# EAGLE schematic PF (EAGLE 9.6.2)
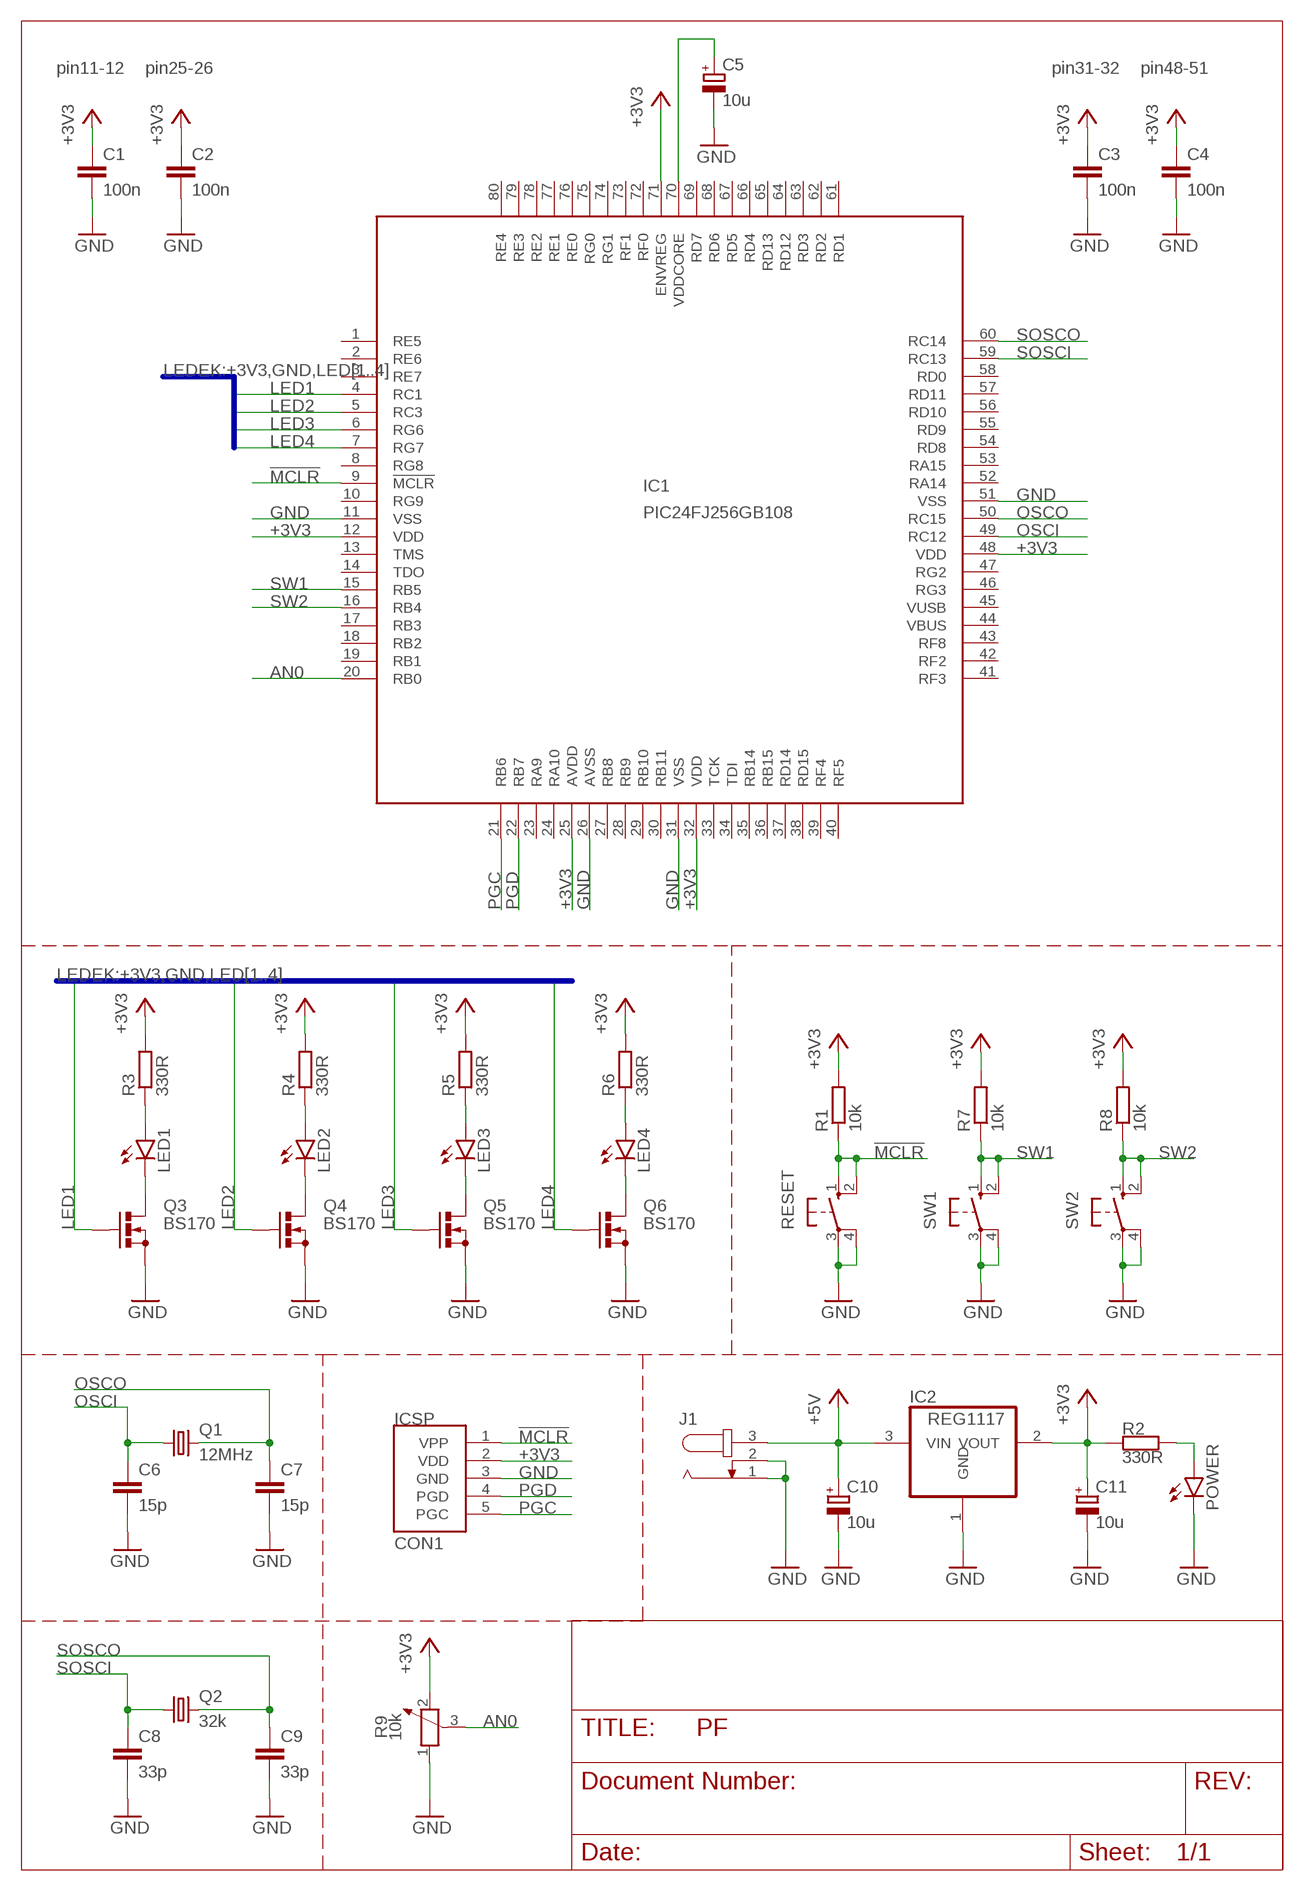
[diagram p0: schematic, sheet 1]

## Parts
C1  100n  C-EUC1206  [C1206]
C2  100n  C-EUC1206  [C1206]
C3  100n  C-EUC1206  [C1206]
C4  100n  C-EUC1206  [C1206]
C5  10u  CPOL-EUSMCD  [SMC_D]
C6  15p  C-EUC1206  [C1206]
C7  15p  C-EUC1206  [C1206]
C8  33p  C-EUC1206  [C1206]
C9  33p  C-EUC1206  [C1206]
C10  10u  CPOL-EUSMCD  [SMC_D]
C11  10u  CPOL-EUSMCD  [SMC_D]
CON1  ICSP  [ICSP]
IC1  PIC24FJ256GB108  [TQFP80-12X12]
IC2  REG1117  [SOT223]
J1  JACK-PLUG0  [SPC4077]
LED1  LED5MM  [LED5MM]
LED2  LED5MM  [LED5MM]
LED3  LED5MM  [LED5MM]
LED4  LED5MM  [LED5MM]
POWER  LED5MM  [LED5MM]
Q1  12MHz  CRYSTALHC49U70  [HC49U70]
Q2  32k  CRYSTALTC26H  [TC26H]
Q3  BS170  [SOT54E]
Q4  BS170  [SOT54E]
Q5  BS170  [SOT54E]
Q6  BS170  [SOT54E]
R1  10k  R-EU_R1206  [R1206]
R2  330R  R-EU_R1206  [R1206]
R3  330R  R-EU_R1206  [R1206]
R4  330R  R-EU_R1206  [R1206]
R5  330R  R-EU_R1206  [R1206]
R6  330R  R-EU_R1206  [R1206]
R7  10k  R-EU_R1206  [R1206]
R8  10k  R-EU_R1206  [R1206]
R9  10k  POTENTIOMETER_PT_SPIN  [PT-SPIN]
RESET  10-XX  [B3F-10XX]
SW1  10-XX  [B3F-10XX]
SW2  10-XX  [B3F-10XX]

## Nets
!MCLR: CON1.1(VPP) IC1.9(!MCLR) R1.1 RESET.1(S) RESET.2(S1)
+3V3 [power]: C1.1 C2.1 C3.1 C4.1 C11.+ CON1.2(VDD) IC1.12(VDD) IC1.25(AVDD) IC1.32(VDD) IC1.48(VDD) IC1.71(ENVREG) IC2.2(VOUT) R1.2 R2.2 R3.2 R4.2 R5.2 R6.2 R7.2 R8.2 R9.2
+5V [power]: C10.+ IC2.3(VIN) J1.3
AN0: IC1.20(RB0) R9.3
GND [power]: C1.2 C2.2 C3.2 C4.2 C5.- C6.2 C7.2 C8.2 C9.2 C10.- C11.- CON1.3(GND) IC1.11(VSS) IC1.26(AVSS) IC1.31(VSS) IC1.51(VSS) IC2.1(GND) J1.1 J1.2 POWER.K(C) Q3.S Q4.S Q5.S Q6.S R9.1 RESET.3(P) RESET.4(P1) SW1.3(P) SW1.4(P1) SW2.3(P) SW2.4(P1)
LED1: IC1.4(RC1) Q3.G
LED2: IC1.5(RC3) Q4.G
LED3: IC1.6(RG6) Q5.G
LED4: IC1.7(RG7) Q6.G
N$1: C5.+ IC1.70(VDDCORE)
N$2: POWER.A R2.1
N$3: LED1.A R3.1
N$4: LED1.K(C) Q3.D
N$5: LED2.A R4.1
N$6: LED3.A R5.1
N$7: LED2.K(C) Q4.D
N$8: LED4.A R6.1
N$10: LED3.K(C) Q5.D
N$13: LED4.K(C) Q6.D
OSCI: C6.1 IC1.49(RC12) Q1.1
OSCO: C7.1 IC1.50(RC15) Q1.2
PGC: CON1.5(PGC) IC1.21(RB6)
PGD: CON1.4(PGD) IC1.22(RB7)
SOSCI: C8.1 IC1.59(RC13) Q2.1
SOSCO: C9.1 IC1.60(RC14) Q2.2
SW1: IC1.15(RB5) R7.1 SW1.1(S) SW1.2(S1)
SW2: IC1.16(RB4) R8.1 SW2.1(S) SW2.2(S1)
Unconnected: IC1.1(RE5) IC1.2(RE6) IC1.3(RE7) IC1.8(RG8) IC1.10(RG9) IC1.13(TMS) IC1.14(TDO) IC1.17(RB3) IC1.18(RB2) IC1.19(RB1) IC1.23(RA9) IC1.24(RA10) IC1.27(RB8) IC1.28(RB9) IC1.29(RB10) IC1.30(RB11) IC1.33(TCK) IC1.34(TDI) IC1.35(RB14) IC1.36(RB15) IC1.37(RD14) IC1.38(RD15) IC1.39(RF4) IC1.40(RF5) IC1.41(RF3) IC1.42(RF2) IC1.43(RF8) IC1.44(VBUS) IC1.45(VUSB) IC1.46(RG3) IC1.47(RG2) IC1.52(RA14) IC1.53(RA15) IC1.54(RD8) IC1.55(RD9) IC1.56(RD10) IC1.57(RD11) IC1.58(RD0) IC1.61(RD1) IC1.62(RD2) IC1.63(RD3) IC1.64(RD12) IC1.65(RD13) IC1.66(RD4) IC1.67(RD5) IC1.68(RD6) IC1.69(RD7) IC1.72(RF0) IC1.73(RF1) IC1.74(RG1) IC1.75(RG0) IC1.76(RE0) IC1.77(RE1) IC1.78(RE2) IC1.79(RE3) IC1.80(RE4)

## Buses
LEDEK:+3V3,GND,LED[1..4]

## Notes on the sheet
- pin11-12 | pin25-26 | pin31-32 | pin48-51

## Library data of the parts
C1-C4 C6-C9 = rcl:C-EU: CAPACITOR, European symbol; SPICEPREFIX: C
C5 C10 C11 = rcl:CPOL-EU: POLARIZED CAPACITOR, European symbol; SPICEPREFIX: C
CON1 = Alkatreszek:ICSP: ICSP csatlakozó 5 pin
IC1 = microchip:PIC24FJ256GB108: PIC24FJ256GB108 edit this description Auto generated by make-symbol-device-package-bsdl.ulp Rev. 25 Source: PIC24FJ256GB108.bsd; MPN: PIC24FJ256GB108-I/PT; OC_FARNELL: 1576869; OC_NEWARK: 54M5131
IC2 = burr-brown:REG1117: 800mA and 1A Low Dropout (LDO) Positive Regulator 1.8V, 2.5V, 2.85V, 3.3V, 5V, and Adj; MPN: REG1117; OC_FARNELL: 1097566; OC_NEWARK: 14P6981
J1 = con-jack:JACK-PLUG: DC POWER JACK Power Jack, DC, Right Angle, Through Hole, Rated 5A at 16VDC, PC Terminals Distributor: Farnell (www.Farnell.de) Drawing: 84N1161.pdf / 84N1162.pdf Manufacturer: SPC Technology (www.spctechnology.com) Type: SPC4077 / SPC 4078; OC_FARNELL: unknown; OC_NEWARK: unknown
LED1-LED4 POWER = led:LED: LED OSRAM: - CHIPLED LG R971, LG N971, LY N971, LG Q971, LY Q971, LO R971, LY R971 LH N974, LH R974 LS Q976, LO Q976, LY Q976 LO Q996 - Hyper CHIPLED LW Q18S LB Q993, LB Q99A, LB R99A - SideLED LS A670, LO A670, LY A670, LG A670, LP A670 LB A673, LV A673, LT A673, LW A673 LH A674 LY A675 LS A676, LA A676, LO A676, LY A676, LW A676 LS A679, LY A679, LG A679 - Hyper Micro SIDELED® LS Y876, LA Y876, LO Y876, LY Y876 LT Y87S - SmartLED LW L88C, LW L88S LB L89C, LB L89S, LG L890 LS L89K, LO L89K, LY L89K LS L896, LA L896, LO L896, LY L896 - TOPLED LS T670, LO T670, LY T670, LG T670, LP T670 LSG T670, LSP T670, LSY T670, LOP T670, LYG T670 LG T671, LOG T671, LSG T671 LB T673, LV T673, LT T673, LW T673 LH T674 LS T676, LA T676, LO T676, LY T676, LB T676, LH T676, LSB T676, LW T676 LB T67C, LV T67C, LT T67C, LS T67K, LO T67K, LY T67K, LW E67C LS E67B, LA E67B, LO E67B, LY E67B, LB E67C, LV E67C, LT E67C LW T67C LS T679, LY T679, LG T679 LS T770, LO T770, LY T770, LG T770, LP T770 LB T773, LV T773, LT T773, LW T773 LH T774 LS E675, LA E675, LY E675, LS T675 LS T776, LA T776, LO T776, LY T776, LB T776 LHGB T686 LT T68C, LB T68C - Hyper Mini TOPLED® LB M676 - Mini TOPLED Santana® LG M470 LS M47K, LO M47K, LY M47K Source: http://www.osram.convergy.de LUXEON: - LUMILED® LXK2-PW12-R00, LXK2-PW12-S00, LXK2-PW14-U00, LXK2-PW14-V00 LXK2-PM12-R00, LXK2-PM12-S00, LXK2-PM14-U00 LXK2-PE12-Q00, LXK2-PE12-R00, LXK2-PE12-S00, LXK2-PE14-T00, LXK2-PE14-U00 LXK2-PB12-K00, LXK2-PB12-L00, LXK2-PB12-M00, LXK2-PB14-N00, LXK2-PB14-P00, LXK2-PB14-Q00 LXK2-PR12-L00, LXK2-PR12-M00, LXK2-PR14-Q00, LXK2-PR14-R00 LXK2-PD12-Q00, LXK2-PD12-R00, LXK2-PD12-S00 LXK2-PH12-R00, LXK2-PH12-S00 LXK2-PL12-P00, LXK2-PL12-Q00, LXK2-PL12-R00 Source: www.luxeon.com KINGBRIGHT: KA-3528ASYC Source: www.kingbright.com
Q1 Q2 = crystal:CRYSTAL: CRYSTAL; OC_FARNELL: unknown; OC_NEWARK: unknown
Q3-Q6 = transistor-small-signal:BS170: N-CHANNEL MOS FET
R1-R8 = rcl:R-EU_: RESISTOR, European symbol; SPICEPREFIX: R
R9 = rcl:POTENTIOMETER_: Potentiometer; SPICEMODEL: POT; SPICEPREFIX: X
RESET SW1 SW2 = switch-omron:10-XX: OMRON SWITCH; MPN: B3F-1000; OC_FARNELL: 176432; OC_NEWARK: 36M3542